# Altium schematic sheet Ethernet.SchDoc
size A3
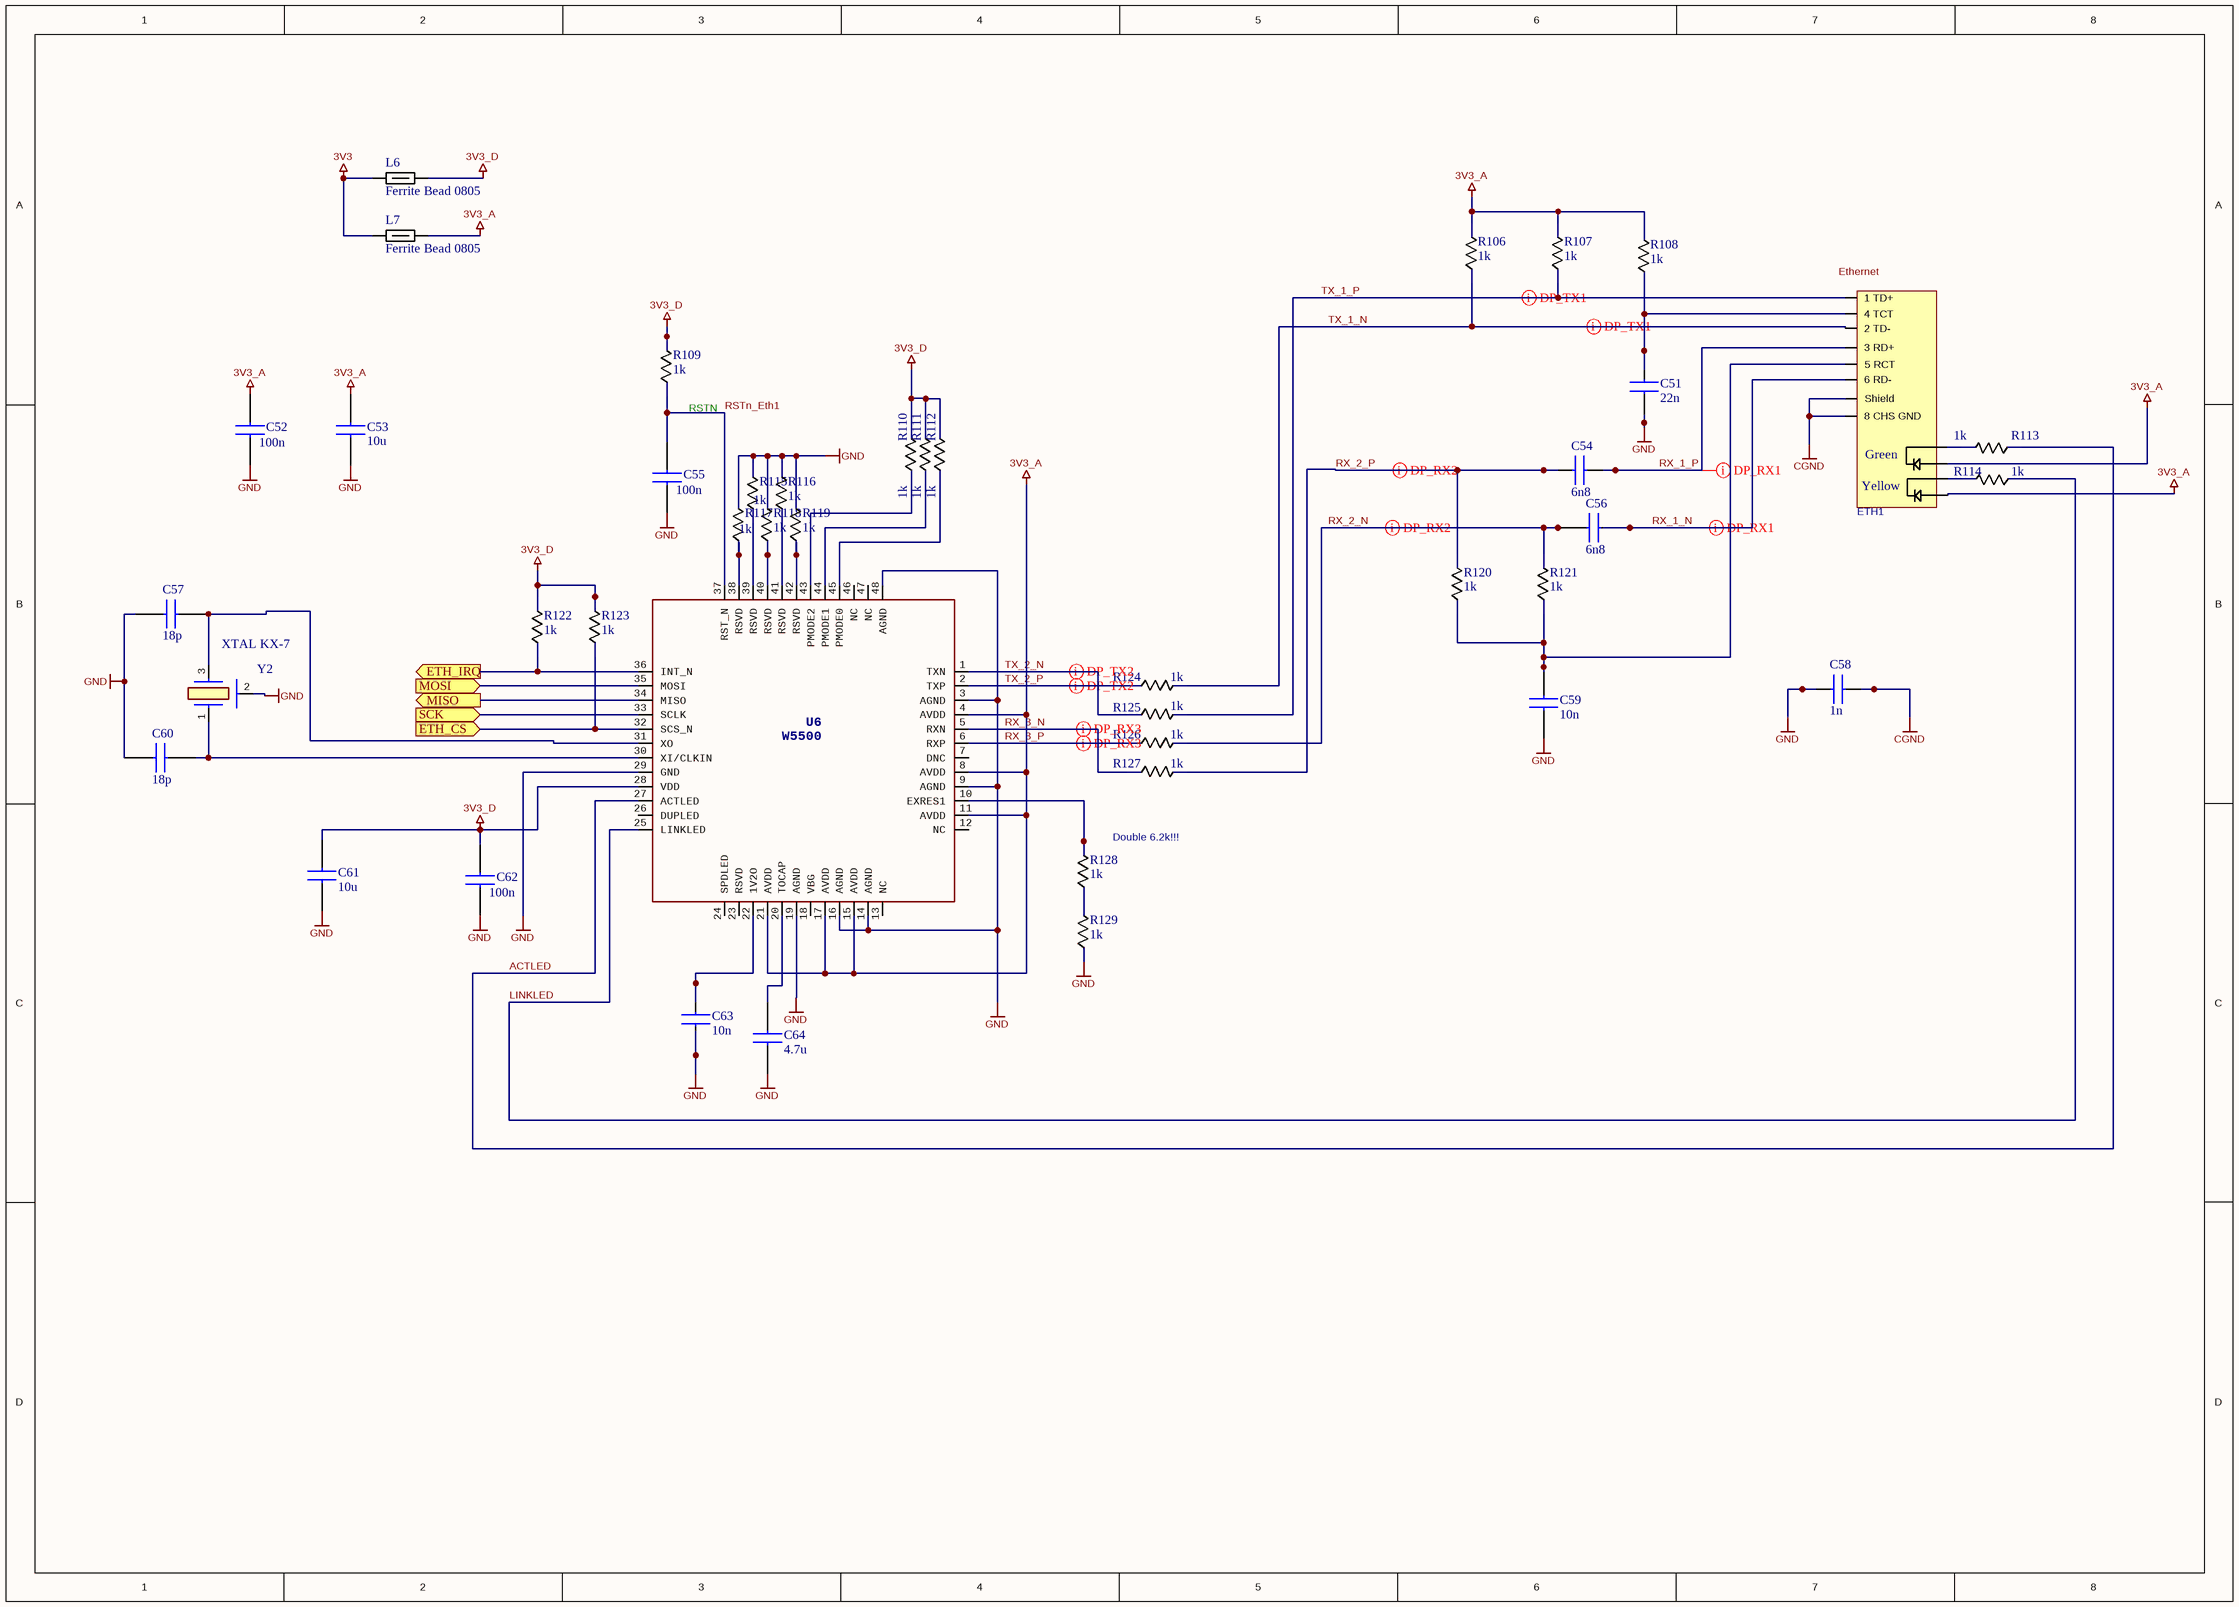
[diagram p0: Ethernet.SchDoc]

## Parts
C51  22n  [0603 CAP]
C52  100n  [0603 CAP]
C53  10u  [0603 CAP]
C54  6n8  [0603 CAP]
C55  100n  [0603 CAP]
C56  6n8  [0603 CAP]
C57  18p  [0603 CAP]
C58  1n  [0603 CAP]
C59  10n  [0603 CAP]
C60  18p  [0603 CAP]
C61  10u  [0603 CAP]
C62  100n  [0603 CAP]
C63  10n  [0603 CAP]
C64  4.7u  [0603 CAP]
ETH1  Ethernet RJ-45 Port  [J011D21BNL]  (value not drawn)
L6  Ferrite Bead 0805  [BLM21AG102BH1J]
L7  Ferrite Bead 0805  [BLM21AG102BH1J]
R106  1k  [0603 CAP]
R107  1k  [0603 CAP]
R108  1k  [0603 CAP]
R109  1k  [0603 CAP]
R110  1k  [0603 CAP]
R111  1k  [0603 CAP]
R112  1k  [0603 CAP]
R113  1k  [0603 CAP]
R114  1k  [0603 CAP]
R115  1k  [0603 CAP]
R116  1k  [0603 CAP]
R117  1k  [0603 CAP]
R118  1k  [0603 CAP]
R119  1k  [0603 CAP]
R120  1k  [0603 CAP]
R121  1k  [0603 CAP]
R122  1k  [0603 CAP]
R123  1k  [0603 CAP]
R124  1k  [0603 CAP]
R125  1k  [0603 CAP]
R126  1k  [0603 CAP]
R127  1k  [0603 CAP]
R128  1k  [0603 CAP]
R129  1k  [0603 CAP]
U6  W5500  [QFP-48]
Y2  XTAL KX-7  [XTAL KX-7]

## Ports
ETH_CS, ETH_IRQ, MISO, MOSI, SCK

## Nets
3V3: L6.1 L7.1
3V3_A: C52.2 C53.2 ETH1.9(LDGr) ETH1.12(LDYE) L7.2 R106.2 R107.2 R108.2 U6.4(AVDD) U6.8(AVDD) U6.11(AVDD) U6.15(AVDD) U6.17(AVDD) U6.21(AVDD)
3V3_D: C61.2 C62.2 L6.2 R109.2 R110.2 R111.2 R112.2 R122.2 R123.2 U6.28(VDD)
CGND: C58.2 ETH1.8(8_CHS_GND) ETH1.SHIELD(Shield)
GND: C51.2 C52.1 C53.1 C55.1 C57.2 C58.1 C59.2 C60.2 C61.1 C62.1 C63.1 C64.1 R115.2 R116.2 R117.2 R118.2 R119.2 R129.1 U6.3(AGND) U6.9(AGND) U6.14(AGND) U6.16(AGND) U6.19(AGND) U6.29(GND) U6.48(AGND) Y2.2
ACTLED: R113.1 U6.27(ACTLED)
ETH_CS: R123.1 U6.32(SCS_N) ; port ETH_CS
ETH_IRQ: R122.1 U6.36(INT_N) ; port ETH_IRQ
LINKLED: R114.1 U6.25(LINKLED)
MISO: U6.34(MISO) ; port MISO
MOSI: U6.35(MOSI) ; port MOSI
RSTn_Eth1: C55.2 R109.1 U6.37(RST_N)
RX_1_N: C56.1 ETH1.6(6_RD-)
RX_1_P: C54.1 ETH1.3(3_RD+)
RX_2_N: C56.2 R121.2 R126.2
RX_2_P: C54.2 R120.2 R127.2
RX_3_N: R127.1 U6.5(RXN)
RX_3_P: R126.1 U6.6(RXP)
SCK: U6.33(SCLK) ; port SCK
TX_1_N: ETH1.2(2_TD-) R106.1 R124.2
TX_1_P: ETH1.1(1_TD+) R107.1 R125.2
TX_2_N: R125.1 U6.1(TXN)
TX_2_P: R124.1 U6.2(TXP)
NetC51_1: C51.1 ETH1.4(4_TCT) R108.1
NetC57_1: C57.1 U6.31(XO) Y2.3
NetC59_1: C59.1 ETH1.5(5_RCT) R120.1 R121.1
NetC60_1: C60.1 U6.30(XI/CLKIN) Y2.1
NetC63_2: C63.2 U6.22(1V2O)
NetC64_2: C64.2 U6.20(TOCAP)
NetETH1_10: ETH1.10(LDGr) R113.2
NetETH1_11: ETH1.11(LDYE) R114.2
NetR110_1: R110.1 U6.43(PMODE2)
NetR111_1: R111.1 U6.44(PMODE1)
NetR112_1: R112.1 U6.45(PMODE0)
NetR115_1: R115.1 U6.39(RSVD)
NetR116_1: R116.1 U6.41(RSVD)
NetR117_1: R117.1 U6.38(RSVD)
NetR118_1: R118.1 U6.40(RSVD)
NetR119_1: R119.1 U6.42(RSVD)
NetR128_1: R128.1 R129.2
NetR128_2: R128.2 U6.10(EXRES1)

Not connected (* = marked no-connect by the designer): U6 7(DNC) 12(NC) 13(NC) 18(VBG) 23(RSVD) 24(SPDLED) 26(DUPLED) 46(NC) 47(NC)

## Layout directives
differential pair: RX_1_N, RX_1_P, RX_2_N, RX_2_P, RX_3_N, RX_3_P, TX_1_N, TX_1_P, TX_2_N, TX_2_P

## Notes on the sheet
- (near ETH1) Ethernet
- (near R109) RSTN
- (near R128) Double 6.2k!!!
- (in symbol J0011D21BNL) Green; Yellow

## Library data of the parts
C51 = 0603 CAP: GRM188R71H223KA01D; Manufacturer_Name: Murata Electronics; Manufacturer_Part_Number: GRM188R72A103KA01D; Datasheet Link: https://search.murata.co.jp/Ceramy/image/img/A01X/G101/ENG/GRM188R72A103KA01-01A.pdf; Height: 0.9mm; Mouser Part Number: 81-GRM188R72A103KA1D; Mouser Price/Stock: https://www.mouser.co.uk/ProductDetail/Murata-Electronics/GRM188R72A103KA01D?qs=krk%2F6UQjCzAtl9phuocbug%3D%3D; Arrow Part Number: GRM188R72A103KA01D; Arrow Price/Stock: https://www.arrow.com/en/products/grm188r72a103ka01d/murata-manufacturing?region=europe
C52 C55 C62 = 0603 CAP: CC0603KRX7R9BB104; Manufacturer_Name: Murata Electronics; Manufacturer_Part_Number: GRM188R72A103KA01D; Datasheet Link: https://search.murata.co.jp/Ceramy/image/img/A01X/G101/ENG/GRM188R72A103KA01-01A.pdf; Height: 0.9mm; Mouser Part Number: 81-GRM188R72A103KA1D; Mouser Price/Stock: https://www.mouser.co.uk/ProductDetail/Murata-Electronics/GRM188R72A103KA01D?qs=krk%2F6UQjCzAtl9phuocbug%3D%3D; Arrow Part Number: GRM188R72A103KA01D; Arrow Price/Stock: https://www.arrow.com/en/products/grm188r72a103ka01d/murata-manufacturing?region=europe
C53 C61 = 0603 CAP: GRM188R61E105KA12D; Manufacturer_Name: Murata Electronics; Manufacturer_Part_Number: GRM188R72A103KA01D; Datasheet Link: https://search.murata.co.jp/Ceramy/image/img/A01X/G101/ENG/GRM188R72A103KA01-01A.pdf; Height: 0.9mm; Mouser Part Number: 81-GRM188R72A103KA1D; Mouser Price/Stock: https://www.mouser.co.uk/ProductDetail/Murata-Electronics/GRM188R72A103KA01D?qs=krk%2F6UQjCzAtl9phuocbug%3D%3D; Arrow Part Number: GRM188R72A103KA01D; Arrow Price/Stock: https://www.arrow.com/en/products/grm188r72a103ka01d/murata-manufacturing?region=europe
C54 C56 = 0603 CAP: CC0603KRX7R9BB682; Manufacturer_Name: Murata Electronics; Manufacturer_Part_Number: GRM188R72A103KA01D; Datasheet Link: https://search.murata.co.jp/Ceramy/image/img/A01X/G101/ENG/GRM188R72A103KA01-01A.pdf; Height: 0.9mm; Mouser Part Number: 81-GRM188R72A103KA1D; Mouser Price/Stock: https://www.mouser.co.uk/ProductDetail/Murata-Electronics/GRM188R72A103KA01D?qs=krk%2F6UQjCzAtl9phuocbug%3D%3D; Arrow Part Number: GRM188R72A103KA01D; Arrow Price/Stock: https://www.arrow.com/en/products/grm188r72a103ka01d/murata-manufacturing?region=europe
C57 C60 = 0603 CAP: CC0603JRNPO9BN180; Manufacturer_Name: Murata Electronics; Manufacturer_Part_Number: GRM188R72A103KA01D; Datasheet Link: https://search.murata.co.jp/Ceramy/image/img/A01X/G101/ENG/GRM188R72A103KA01-01A.pdf; Height: 0.9mm; Mouser Part Number: 81-GRM188R72A103KA1D; Mouser Price/Stock: https://www.mouser.co.uk/ProductDetail/Murata-Electronics/GRM188R72A103KA01D?qs=krk%2F6UQjCzAtl9phuocbug%3D%3D; Arrow Part Number: GRM188R72A103KA01D; Arrow Price/Stock: https://www.arrow.com/en/products/grm188r72a103ka01d/murata-manufacturing?region=europe
C58 = 0603 CAP: CC1206KKX7RDBB102; Manufacturer_Name: Murata Electronics; Manufacturer_Part_Number: GRM188R72A103KA01D; Datasheet Link: https://search.murata.co.jp/Ceramy/image/img/A01X/G101/ENG/GRM188R72A103KA01-01A.pdf; Height: 0.9mm; Mouser Part Number: 81-GRM188R72A103KA1D; Mouser Price/Stock: https://www.mouser.co.uk/ProductDetail/Murata-Electronics/GRM188R72A103KA01D?qs=krk%2F6UQjCzAtl9phuocbug%3D%3D; Arrow Part Number: GRM188R72A103KA01D; Arrow Price/Stock: https://www.arrow.com/en/products/grm188r72a103ka01d/murata-manufacturing?region=europe
C59 C63 = 0603 CAP: CC0603JRX7R9BB103; Manufacturer_Name: Murata Electronics; Manufacturer_Part_Number: GRM188R72A103KA01D; Datasheet Link: https://search.murata.co.jp/Ceramy/image/img/A01X/G101/ENG/GRM188R72A103KA01-01A.pdf; Height: 0.9mm; Mouser Part Number: 81-GRM188R72A103KA1D; Mouser Price/Stock: https://www.mouser.co.uk/ProductDetail/Murata-Electronics/GRM188R72A103KA01D?qs=krk%2F6UQjCzAtl9phuocbug%3D%3D; Arrow Part Number: GRM188R72A103KA01D; Arrow Price/Stock: https://www.arrow.com/en/products/grm188r72a103ka01d/murata-manufacturing?region=europe
C64 = 0603 CAP: GRM188R61A475KE15D; Manufacturer_Name: Murata Electronics; Manufacturer_Part_Number: GRM188R72A103KA01D; Datasheet Link: https://search.murata.co.jp/Ceramy/image/img/A01X/G101/ENG/GRM188R72A103KA01-01A.pdf; Height: 0.9mm; Mouser Part Number: 81-GRM188R72A103KA1D; Mouser Price/Stock: https://www.mouser.co.uk/ProductDetail/Murata-Electronics/GRM188R72A103KA01D?qs=krk%2F6UQjCzAtl9phuocbug%3D%3D; Arrow Part Number: GRM188R72A103KA01D; Arrow Price/Stock: https://www.arrow.com/en/products/grm188r72a103ka01d/murata-manufacturing?region=europe
ETH1 = J0011D21BNL
L6 L7 = Ferrite Bead
R106-R129 = 0603 RES
Y2 = XTAL KX-7: Crystal or Oscillator; Manufacturer_Name: NDK; Manufacturer_Part_Number: NX3215SA-32.768K-STD-MUA-14; Datasheet Link: https://www.mouser.com/datasheet/2/905/c_NX3215SA-STD-MUA-14_e-1317539.pdf; Height: 0.9mm; Mouser Part Number: 344-NX3215SA32768K14; Mouser Price/Stock: https://www.mouser.co.uk/ProductDetail/NDK/NX3215SA-32.768K-STD-MUA-14?qs=55YtniHzbhCTyKGENMTVrQ%3D%3D